# Altium schematic sheet Sheet3.SchDoc
size A4
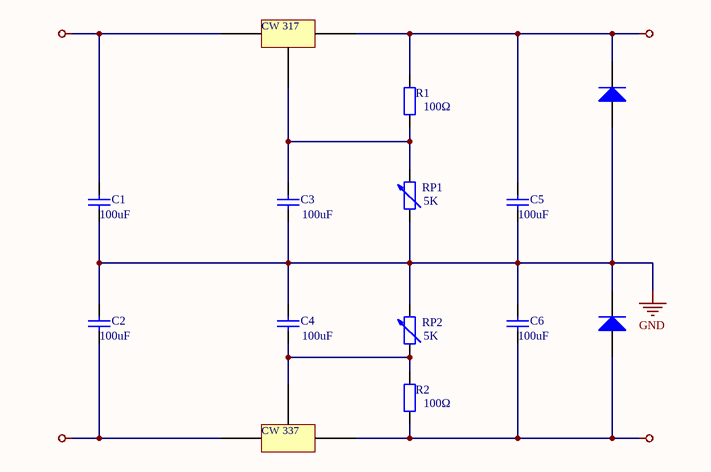
[diagram p0: Sheet3.SchDoc]

## Parts
(Parts that share a designator on the sheet are numbered #1, #2 ... from top to bottom, then left to right.)
*#1  Component_4  (value not drawn)
*#2  Component_5  (value not drawn)
C1  value 100uF  [RAD-0.3]  (hidden comment: Cap)
C2  value 100uF  [RAD-0.3]  (hidden comment: Cap)
C3  value 100uF  [RAD-0.3]  (hidden comment: Cap)
C4  value 100uF  [RAD-0.3]  (hidden comment: Cap)
C5  value 100uF  [RAD-0.3]  (hidden comment: Cap)
C6  value 100uF  [RAD-0.3]  (hidden comment: Cap)
D?#1  Diode  [SMC]  (value not drawn)
D?#2  Diode  [SMC]  (value not drawn)
R1  value 100Ω  [AXIAL-0.4]  (hidden comment: Res2)
R2  value 100Ω  [AXIAL-0.4]  (hidden comment: Res2)
RP1  value 5K  [AXIAL-0.6]  (hidden comment: Res Adj2)
RP2  value 5K  [AXIAL-0.6]  (hidden comment: Res Adj2)

## Nets
GND: *#1.17 *#1.19 *#2.17 *#2.19 C1.1 C1.2 C2.1 C2.2 C3.1 C4.2 C5.1 C5.2 C6.1 C6.2 D?#1.1(A) D?#1.2(K) D?#2.1(A) D?#2.2(K) R1.2 R2.1 RP1.1 RP2.2
Net*#1_18: *#1.18 C3.2 R1.1 RP1.2
Net*#2_18: *#2.18 C4.1 R2.2 RP2.1

## Notes on the sheet
- (in symbol Component_4) CW 317
- (in symbol Component_5) CW 337

## Library data of the parts
C1-C6 = Cap: Capacitor; Published: 8-Jun-2000; LatestRevisionDate: 17-Jul-2002; LatestRevisionNote: Re-released for DXP Platform.; PackageReference: RAD-0.3; Publisher: Altium Limited; PackageDescription: Radial Cap, Thru-Hole; 2 Leads; 0.3 in Pin Spacing
D?#1 D?#2 = Diode: Default Diode; Published: 8-Jun-2000; LatestRevisionDate: 17-Jul-2002; LatestRevisionNote: Re-released for DXP Platform.; PackageVersion: Sep-1996; PackageReference: SMC; Publisher: Altium Limited; PackageDescription: DO-214-AB/SMC; 2 C-Bend Leads; Body 7.9 x 5.9 mm, inc. leads (LxW); Code_JEDEC: DO-214-AB
R1 R2 = Res2: Resistor; Published: 8-Jun-2000; LatestRevisionDate: 17-Jul-2002; LatestRevisionNote: Re-released for DXP Platform.; PackageReference: AXIAL-0.4; Publisher: Altium Limited; PackageDescription: Axial Device, Thru-Hole; 2 Leads; 0.4 in Pin Spacing
RP1 RP2 = Res Adj2: Variable Resistor; Set Position: 0.5; Published: 8-Jun-2000; LatestRevisionDate: 17-Jul-2002; LatestRevisionNote: Re-released for DXP Platform.; PackageReference: AXIAL-0.6; Publisher: Altium Limited; PackageDescription: Axial Device, Thru-Hole; 2 Leads; 0.6 in Pin Spacing